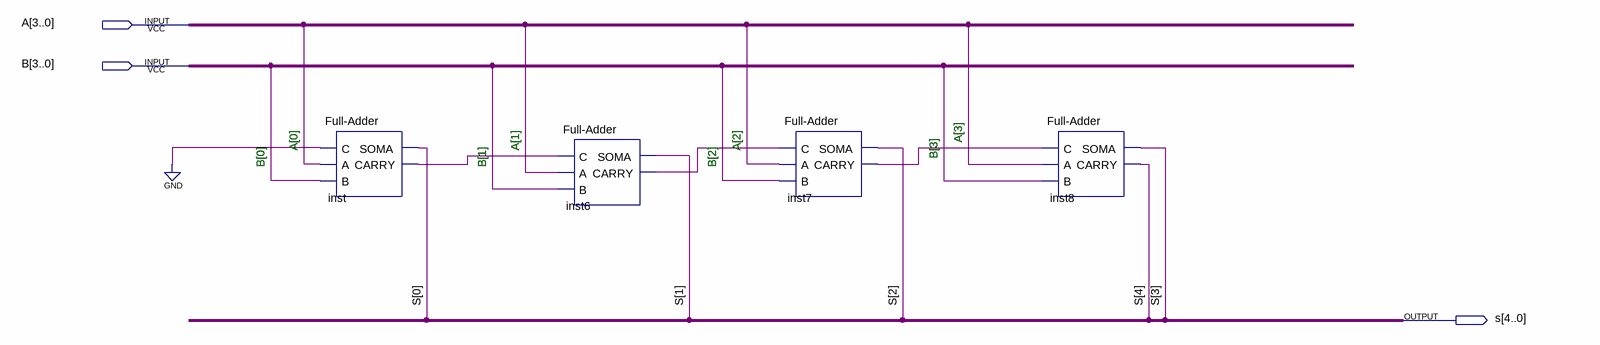
[diagram p0: schematic sheet]
// Quartus schematic Somador4BitsOK.bdf as structural Verilog: 4 symbols, 3 pins
module Somador4BitsOK (
  input  [3:0] A,
  input  [3:0] B,
  output [4:0] s
);

  wire inst6_carry, inst7_carry, inst_carry;

  \Full-Adder  inst (.C(1'b0), .A(A[0]), .B(B[0]), .SOMA(s[0]), .CARRY(inst_carry));
  \Full-Adder  inst6 (.C(inst_carry), .A(A[1]), .B(B[1]), .SOMA(s[1]), .CARRY(inst6_carry));
  \Full-Adder  inst7 (.C(inst6_carry), .A(A[2]), .B(B[2]), .SOMA(s[2]), .CARRY(inst7_carry));
  \Full-Adder  inst8 (.C(inst7_carry), .A(A[3]), .B(B[3]), .SOMA(s[3]), .CARRY(s[4]));

  // Notes on the sheet:
  //   A[3]
  //   A[0]
  //   A[1]
  //   A[2]
  //   B[3]
  //   B[0]
  //   B[1]
  //   B[2]
endmodule
